# EAGLE schematic SchemaCircuito5Sensori (EAGLE 7.7.0)
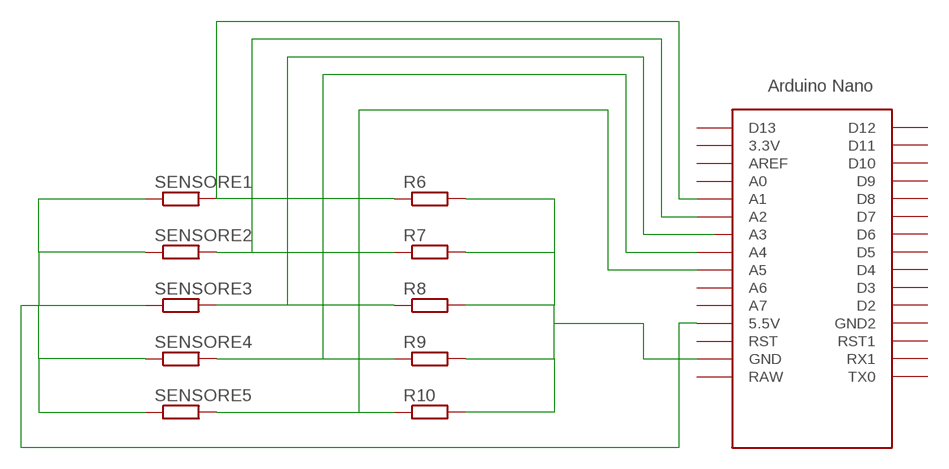
[diagram p0: schematic, sheet 1]

## Parts
R6  R-EU_0207/10  [0207/10]
R7  R-EU_0207/10  [0207/10]
R8  R-EU_0207/10  [0207/10]
R9  R-EU_0207/10  [0207/10]
R10  R-EU_0207/10  [0207/10]
SENSORE1  R-EU_0207/10  [0207/10]
SENSORE2  R-EU_0207/10  [0207/10]
SENSORE3  R-EU_0207/10  [0207/10]
SENSORE4  R-EU_0207/10  [0207/10]
SENSORE5  R-EU_0207/10  [0207/10]
U$1  NANO  [NANO]

## Nets
N$1: R10.1 SENSORE5.2
N$2: R9.1 SENSORE4.2 U$1.A4
N$3: R7.1 SENSORE2.2 U$1.A2
N$4: R6.1 SENSORE1.2 U$1.A1
N$5: R8.1 SENSORE3.2 U$1.A3
N$6: U$1.A5
N$7: R6.2 R7.2 R8.2 R9.2 R10.2 U$1.GND
N$8: SENSORE1.1 SENSORE2.1 SENSORE3.1 SENSORE4.1 SENSORE5.1 U$1.5V(5.5V)
Unconnected: U$1.3.3V U$1.A0 U$1.A6 U$1.A7 U$1.AREF U$1.D2 U$1.D3 U$1.D4 U$1.D5 U$1.D6 U$1.D7 U$1.D8 U$1.D9 U$1.D10 U$1.D11 U$1.D12 U$1.D13 U$1.GND1(GND2) U$1.ICSP1 U$1.ICSP2 U$1.ICSP3 U$1.ICSP4 U$1.ICSP5 U$1.ICSP6 U$1.RAW U$1.RST U$1.RST1 U$1.RX1 U$1.TX0

## Library data of the parts
R6-R10 SENSORE1-SENSORE5 = resistor:R-EU_: RESISTOR, European symbol
U$1 = Arduino-clone:NANO: Arduino Nano